# Altium schematic sheet adc-power.SchDoc: ADC - Power
size Letter; CheckedBy: J. Brinton; CompanyName: Signal Laboratories, Inc.; DrawnBy: J. Brinton; Engineer: J. Brinton; Address1: 3479 Edison Way; Address2: Menlo Park CA 94025; Address3: +1 (877) 778-8435; Address4: siglabs.com; Revision: 3; SheetNumber: 22; SheetTotal: 49
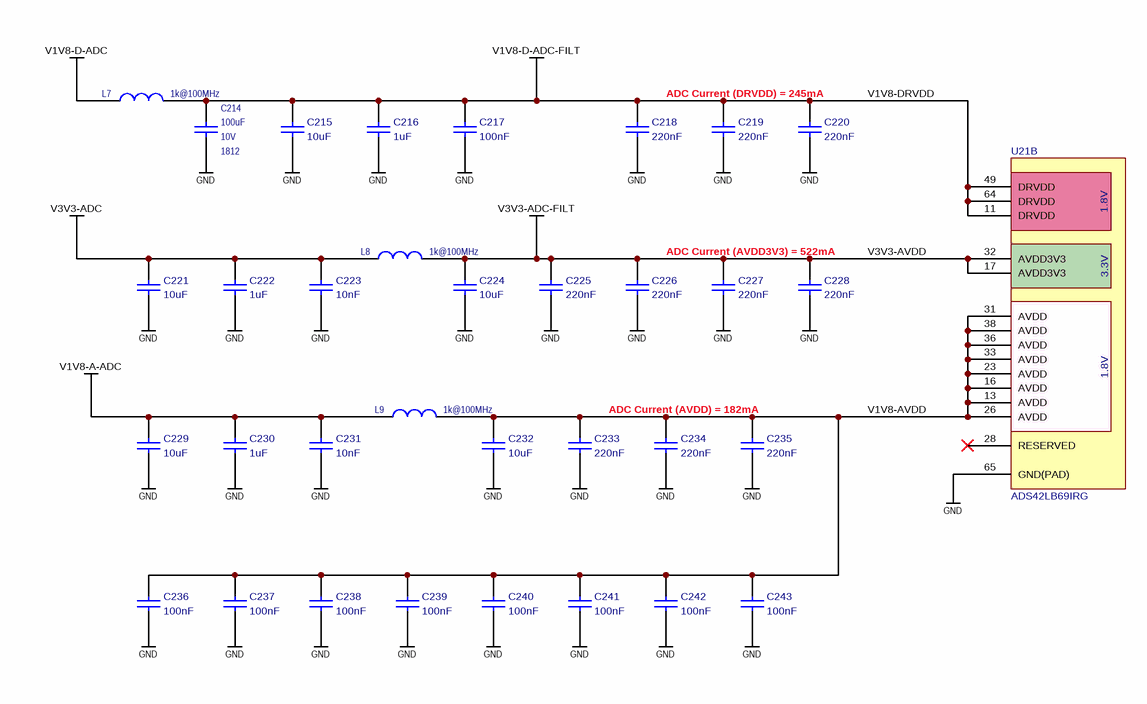
[diagram p0: adc-power.SchDoc]

## Parts
C214  value 100uF  Voltage: 10V  Package: 1812  [CAPC450X320X360L20N]  (hidden comment: C4532X5R1A107M280KC)
C215  value 10uF  [CAPC200X125X145L45N]  (hidden comment: CL21B106KOQNNNE)
C216  value 1uF  [CAPC200X125X145L45N]  (hidden comment: TMK212B7105KG)
C217  value 100nF  [CAPC100X50X55L25N]  (hidden comment: CC0402KRX7R8BB104)
C218  value 220nF  [CAPC100X50X55L25N]  (hidden comment: C1005X7R1E224K050BE)
C219  value 220nF  [CAPC100X50X55L25N]  (hidden comment: C1005X7R1E224K050BE)
C220  value 220nF  [CAPC100X50X55L25N]  (hidden comment: C1005X7R1E224K050BE)
C221  value 10uF  [CAPC200X125X145L45N]  (hidden comment: CL21B106KOQNNNE)
C222  value 1uF  [CAPC200X125X145L45N]  (hidden comment: TMK212B7105KG)
C223  value 10nF  [CAPC100X50X55L25N]  (hidden comment: GRM155R71H103KA88)
C224  value 10uF  [CAPC200X125X145L45N]  (hidden comment: CL21B106KOQNNNE)
C225  value 220nF  [CAPC100X50X55L25N]  (hidden comment: C1005X7R1E224K050BE)
C226  value 220nF  [CAPC100X50X55L25N]  (hidden comment: C1005X7R1E224K050BE)
C227  value 220nF  [CAPC100X50X55L25N]  (hidden comment: C1005X7R1E224K050BE)
C228  value 220nF  [CAPC100X50X55L25N]  (hidden comment: C1005X7R1E224K050BE)
C229  value 10uF  [CAPC200X125X145L45N]  (hidden comment: CL21B106KOQNNNE)
C230  value 1uF  [CAPC200X125X145L45N]  (hidden comment: TMK212B7105KG)
C231  value 10nF  [CAPC100X50X55L25N]  (hidden comment: GRM155R71H103KA88)
C232  value 10uF  [CAPC200X125X145L45N]  (hidden comment: CL21B106KOQNNNE)
C233  value 220nF  [CAPC100X50X55L25N]  (hidden comment: C1005X7R1E224K050BE)
C234  value 220nF  [CAPC100X50X55L25N]  (hidden comment: C1005X7R1E224K050BE)
C235  value 220nF  [CAPC100X50X55L25N]  (hidden comment: C1005X7R1E224K050BE)
C236  value 100nF  [CAPC100X50X55L25N]  (hidden comment: CC0402KRX7R8BB104)
C237  value 100nF  [CAPC100X50X55L25N]  (hidden comment: CC0402KRX7R8BB104)
C238  value 100nF  [CAPC100X50X55L25N]  (hidden comment: CC0402KRX7R8BB104)
C239  value 100nF  [CAPC100X50X55L25N]  (hidden comment: CC0402KRX7R8BB104)
C240  value 100nF  [CAPC100X50X55L25N]  (hidden comment: CC0402KRX7R8BB104)
C241  value 100nF  [CAPC100X50X55L25N]  (hidden comment: CC0402KRX7R8BB104)
C242  value 100nF  [CAPC100X50X55L25N]  (hidden comment: CC0402KRX7R8BB104)
C243  value 100nF  [CAPC100X50X55L25N]  (hidden comment: CC0402KRX7R8BB104)
L7  value 1k@100MHz  [1806]  (hidden comment: BLM41PG102SN1L)
L8  value 1k@100MHz  [1806]  (hidden comment: BLM41PG102SN1L)
L9  value 1k@100MHz  [1806]  (hidden comment: BLM41PG102SN1L)
U21  ADS42LB69IRG  [S-PVQFN-N64]  (part B of 4)

## Nets
GND: C214.1 C215.2 C216.2 C217.2 C218.2 C219.2 C220.2 C221.2 C222.2 C223.2 C224.2 C225.2 C226.2 C227.2 C228.2 C229.2 C230.2 C231.2 C232.2 C233.2 C234.2 C235.2 C236.2 C237.2 C238.2 C239.2 C240.2 C241.2 C242.2 C243.2 U21.65(GND(PAD))
V1V8-A-ADC: C229.1 C230.1 C231.1 L9.1
V1V8-D-ADC: L7.1
V1V8-DRVDD: C214.2 C215.1 C216.1 C217.1 C218.1 C219.1 C220.1 L7.2 U21.11(DRVDD) U21.49(DRVDD) U21.64(DRVDD)  [also labelled V1V8-D-ADC-FILT]
V3V3-ADC: C221.1 C222.1 C223.1 L8.1
V3V3-AVDD: C224.1 C225.1 C226.1 C227.1 C228.1 L8.2 U21.17(AVDD3V3) U21.32(AVDD3V3)  [also labelled V3V3-ADC-FILT]
V1V8-AVDD: C232.1 C233.1 C234.1 C235.1 C236.1 C237.1 C238.1 C239.1 C240.1 C241.1 C242.1 C243.1 L9.2 U21.13(AVDD) U21.16(AVDD) U21.23(AVDD) U21.26(AVDD) U21.31(AVDD) U21.33(AVDD) U21.36(AVDD) U21.38(AVDD)

Not connected (* = marked no-connect by the designer): U21 28(RESERVED)*

## Notes on the sheet
- ADC Current (DRVDD) = 245mA
- ADC Current (AVDD3V3) = 522mA
- ADC Current (AVDD) = 182mA
- Title
- Engineer
- Revision
- Drawn By
- Checked By
- Date
- Sheet
- of
- (in symbol ADS42LB69IRG, part B) 1.8V; 3.3V

## Library data of the parts
C214 = CAP 0603: Ceramic Capacitor 100uF ±20% 10V X5R 1812; Manufacturer: TDK; Tr: -55:85; Manufacturer P/N: C4532X5R1A107M280KC; Tolerance: ±20%
C215 C221 C224 C229 C232 = LMK212B7106KG: Ceramic Capacitor 10uF ±10% 16V X7R 0805; Manufacturer: Samsung; Tr: -55:105; Manufacturer P/N: CL21B106KOQNNNE; Tolerance: ±10%; Package: 0805; Voltage: 16V
C216 C222 C230 = TMK212B7105KG: Ceramic Capacitor 1uF ±10% 25V X7R 0805; Manufacturer: Taiyo Yuden; Manufacturer P/N: TMK212B7105KG; Tolerance: ±10%; Tr: *; Package: 0805; Voltage: 25V
C217 C236-C243 = TMK105B7104KV: Ceramic Capacitor 100nF ±10% 25V X7R 0402; Manufacturer: Yageo; Tolerance: ±10%; Tr: *; Package: 0402; Voltage: 25V
  C217: Manufacturer P/N: CC0402KRX7R8BB104
  C236-C243: Manufacturer P/N: TMK105B7104KV
C218-C220 C225-C228 C233-C235 = TMK105B7224KV: Ceramic Capacitor 220nF ±10% 25V X7R 0402; Manufacturer: TDK; Manufacturer P/N: C1005X7R1E224K050BE; Tolerance: ±10%; Tr: *; Package: 0402; Voltage: 25V
C223 C231 = TMK105B7103KV: Ceramic Capacitor 10nF ±10% 50V X7R 0402; Manufacturer: Murata; Tr: -55:125; Manufacturer P/N: GRM155R71H103KA88; Tolerance: ±10%; Package: 0402
L7-L9 = INDUCTANCE1: Ferrite Bead 1k@100MHz 1.5A 1806; Manufacturer: Murata; Tr: -55:125; Manufacturer P/N: BLM41PG102SN1L; Package: 1806
U21 = ADS42LB69IRG: Dual-Channel, 16-Bit, 250-MSPS Analog-to-Digital Converter; Manufacturer: Texas Instruments; Manufacturer P/N: ADS42LB69IRG